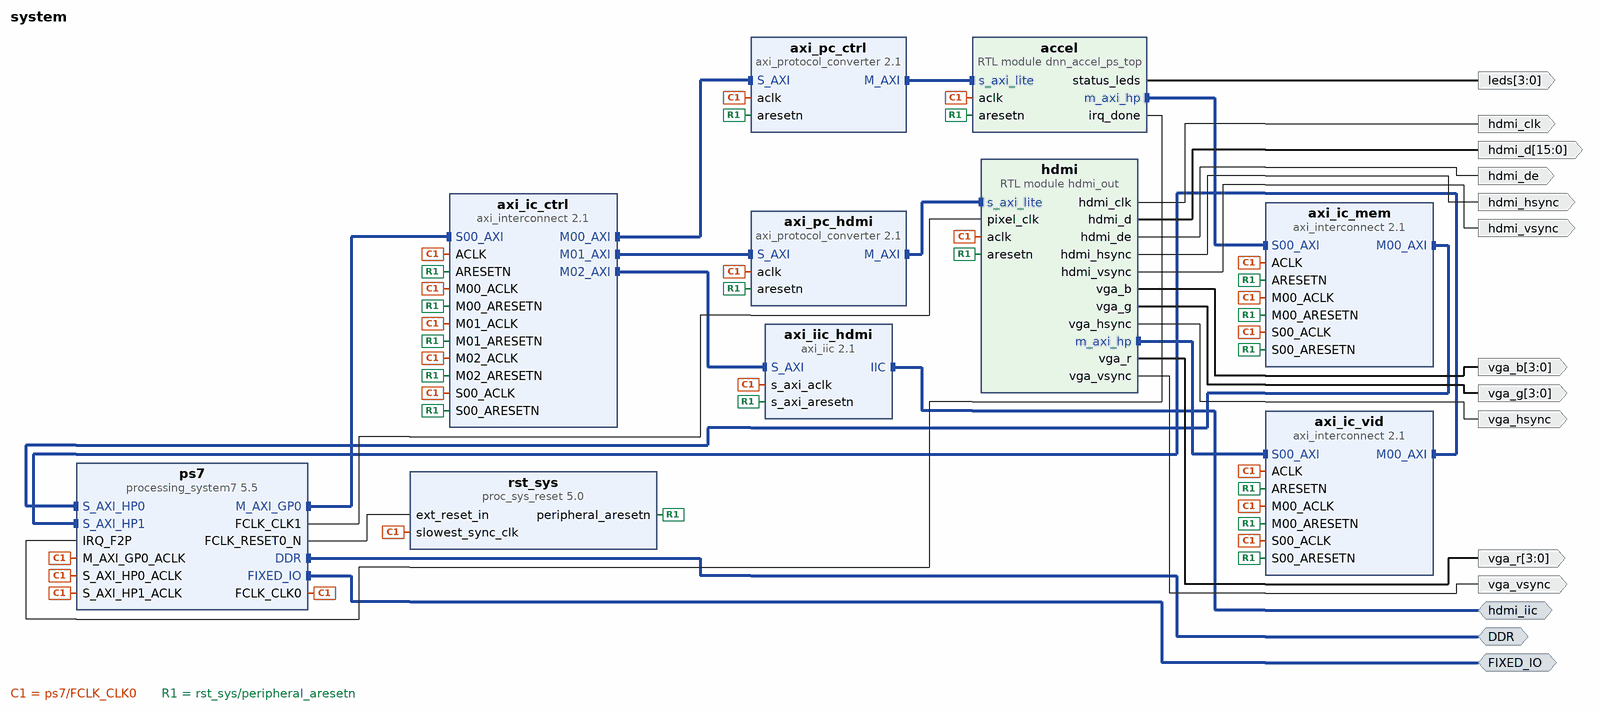
[diagram p0: block diagram of the top level]
# Vivado block design system, xc7z020clg484-1, Vivado 2025.2
create_bd_design system

create_bd_intf_port -mode Master -vlnv xilinx.com:interface:ddrx_rtl:1.0 DDR
create_bd_intf_port -mode Master -vlnv xilinx.com:display_processing_system7:fixedio_rtl:1.0 FIXED_IO
create_bd_intf_port -mode Master -vlnv xilinx.com:interface:iic_rtl:1.0 hdmi_iic
create_bd_port -dir O -from 3 -to 0 leds
create_bd_port -dir O hdmi_clk
create_bd_port -dir O -from 15 -to 0 hdmi_d
create_bd_port -dir O hdmi_de
create_bd_port -dir O hdmi_hsync
create_bd_port -dir O hdmi_vsync
create_bd_port -dir O -from 3 -to 0 vga_r
create_bd_port -dir O -from 3 -to 0 vga_g
create_bd_port -dir O -from 3 -to 0 vga_b
create_bd_port -dir O vga_hsync
create_bd_port -dir O vga_vsync

create_bd_cell -type ip -vlnv xilinx.com:ip:processing_system7:5.5 ps7
set_property -dict [list \
  CONFIG.PCW_APU_PERIPHERAL_FREQMHZ 650 \
  CONFIG.PCW_ENET0_ENET0_IO {MIO 16 .. 27} \
  CONFIG.PCW_ENET0_GRP_MDIO_ENABLE 1 \
  CONFIG.PCW_ENET0_GRP_MDIO_IO EMIO \
  CONFIG.PCW_ENET0_PERIPHERAL_ENABLE 1 \
  CONFIG.PCW_ENET0_RESET_ENABLE 0 \
  CONFIG.PCW_ENET_RESET_ENABLE 1 \
  CONFIG.PCW_ENET_RESET_SELECT {Share reset pin} \
  CONFIG.PCW_EN_CLK1_PORT 1 \
  CONFIG.PCW_FCLK_CLK1_BUF TRUE \
  CONFIG.PCW_FPGA0_PERIPHERAL_FREQMHZ 100 \
  CONFIG.PCW_FPGA1_PERIPHERAL_FREQMHZ 25 \
  CONFIG.PCW_FPGA_FCLK1_ENABLE 1 \
  CONFIG.PCW_GPIO_MIO_GPIO_ENABLE 1 \
  CONFIG.PCW_GPIO_MIO_GPIO_IO MIO \
  CONFIG.PCW_I2C_RESET_ENABLE 1 \
  CONFIG.PCW_IRQ_F2P_INTR 1 \
  CONFIG.PCW_PRESET_BANK1_VOLTAGE {LVCMOS 1.8V} \
  CONFIG.PCW_QSPI_GRP_FBCLK_ENABLE 1 \
  CONFIG.PCW_QSPI_GRP_FBCLK_IO {MIO 8} \
  CONFIG.PCW_QSPI_GRP_SINGLE_SS_ENABLE 1 \
  CONFIG.PCW_QSPI_GRP_SINGLE_SS_IO {MIO 1 .. 6} \
  CONFIG.PCW_QSPI_PERIPHERAL_ENABLE 1 \
  CONFIG.PCW_QSPI_QSPI_IO {MIO 1 .. 6} \
  CONFIG.PCW_SD0_GRP_CD_ENABLE 1 \
  CONFIG.PCW_SD0_GRP_CD_IO {MIO 47} \
  CONFIG.PCW_SD0_GRP_WP_ENABLE 1 \
  CONFIG.PCW_SD0_GRP_WP_IO EMIO \
  CONFIG.PCW_SD0_PERIPHERAL_ENABLE 1 \
  CONFIG.PCW_SD0_SD0_IO {MIO 40 .. 45} \
  CONFIG.PCW_SDIO_PERIPHERAL_FREQMHZ 50 \
  CONFIG.PCW_SINGLE_QSPI_DATA_MODE x4 \
  CONFIG.PCW_S_AXI_HP0_DATA_WIDTH 32 \
  CONFIG.PCW_S_AXI_HP1_DATA_WIDTH 32 \
  CONFIG.PCW_TTC0_PERIPHERAL_ENABLE 1 \
  CONFIG.PCW_TTC0_TTC0_IO EMIO \
  CONFIG.PCW_UART1_PERIPHERAL_ENABLE 1 \
  CONFIG.PCW_UART1_UART1_IO {MIO 48 .. 49} \
  CONFIG.PCW_UART_PERIPHERAL_FREQMHZ 100 \
  CONFIG.PCW_UIPARAM_DDR_FREQ_MHZ 525 \
  CONFIG.PCW_UIPARAM_DDR_PARTNO {MT41K128M16 JT-125} \
  CONFIG.PCW_USB0_PERIPHERAL_ENABLE 1 \
  CONFIG.PCW_USB0_RESET_ENABLE 1 \
  CONFIG.PCW_USB0_RESET_IO {MIO 46} \
  CONFIG.PCW_USB0_USB0_IO {MIO 28 .. 39} \
  CONFIG.PCW_USB_RESET_ENABLE 1 \
  CONFIG.PCW_USB_RESET_SELECT {Share reset pin} \
  CONFIG.PCW_USE_FABRIC_INTERRUPT 1 \
  CONFIG.PCW_USE_S_AXI_HP0 1 \
  CONFIG.PCW_USE_S_AXI_HP1 1 \
] [get_bd_cells ps7]
# 220 more settings of ps7 are not shown: defaults, MIO pin electricals, DDR timing, and values the tool derives
create_bd_cell -type module -reference dnn_accel_ps_top accel
create_bd_cell -type module -reference hdmi_out hdmi
create_bd_cell -type ip -vlnv xilinx.com:ip:axi_interconnect:2.1 axi_ic_ctrl
set_property -dict {CONFIG.NUM_MI 3 CONFIG.NUM_SI 1} [get_bd_cells axi_ic_ctrl]
create_bd_cell -type ip -vlnv xilinx.com:ip:axi_iic:2.1 axi_iic_hdmi
create_bd_cell -type ip -vlnv xilinx.com:ip:axi_interconnect:2.1 axi_ic_mem
set_property -dict {CONFIG.NUM_MI 1 CONFIG.NUM_SI 1} [get_bd_cells axi_ic_mem]
create_bd_cell -type ip -vlnv xilinx.com:ip:axi_protocol_converter:2.1 axi_pc_ctrl
create_bd_cell -type ip -vlnv xilinx.com:ip:axi_protocol_converter:2.1 axi_pc_hdmi
create_bd_cell -type ip -vlnv xilinx.com:ip:axi_interconnect:2.1 axi_ic_vid
set_property -dict {CONFIG.NUM_MI 1 CONFIG.NUM_SI 1} [get_bd_cells axi_ic_vid]
create_bd_cell -type ip -vlnv xilinx.com:ip:proc_sys_reset:5.0 rst_sys

# ---- connections ----

connect_bd_intf_net [get_bd_intf_pins accel/m_axi_hp] [get_bd_intf_pins axi_ic_mem/S00_AXI]
connect_bd_intf_net [get_bd_intf_pins axi_ic_ctrl/M00_AXI] [get_bd_intf_pins axi_pc_ctrl/S_AXI]
connect_bd_intf_net [get_bd_intf_pins axi_ic_ctrl/M01_AXI] [get_bd_intf_pins axi_pc_hdmi/S_AXI]
connect_bd_intf_net [get_bd_intf_pins axi_ic_ctrl/M02_AXI] [get_bd_intf_pins axi_iic_hdmi/S_AXI]
connect_bd_intf_net [get_bd_intf_pins axi_ic_mem/M00_AXI] [get_bd_intf_pins ps7/S_AXI_HP0]
connect_bd_intf_net [get_bd_intf_pins axi_ic_vid/M00_AXI] [get_bd_intf_pins ps7/S_AXI_HP1]
connect_bd_intf_net [get_bd_intf_ports hdmi_iic] [get_bd_intf_pins axi_iic_hdmi/IIC]
connect_bd_intf_net [get_bd_intf_pins axi_pc_ctrl/M_AXI] [get_bd_intf_pins accel/s_axi_lite]
connect_bd_intf_net [get_bd_intf_pins axi_pc_hdmi/M_AXI] [get_bd_intf_pins hdmi/s_axi_lite]
connect_bd_intf_net [get_bd_intf_pins hdmi/m_axi_hp] [get_bd_intf_pins axi_ic_vid/S00_AXI]
connect_bd_intf_net [get_bd_intf_ports DDR] [get_bd_intf_pins ps7/DDR]
connect_bd_intf_net [get_bd_intf_ports FIXED_IO] [get_bd_intf_pins ps7/FIXED_IO]
connect_bd_intf_net [get_bd_intf_pins ps7/M_AXI_GP0] [get_bd_intf_pins axi_ic_ctrl/S00_AXI]
connect_bd_net [get_bd_pins accel/irq_done] [get_bd_pins ps7/IRQ_F2P]
connect_bd_net [get_bd_pins accel/status_leds] [get_bd_ports leds]
connect_bd_net [get_bd_pins hdmi/hdmi_clk] [get_bd_ports hdmi_clk]
connect_bd_net [get_bd_pins hdmi/hdmi_d] [get_bd_ports hdmi_d]
connect_bd_net [get_bd_pins hdmi/hdmi_de] [get_bd_ports hdmi_de]
connect_bd_net [get_bd_pins hdmi/hdmi_hsync] [get_bd_ports hdmi_hsync]
connect_bd_net [get_bd_pins hdmi/hdmi_vsync] [get_bd_ports hdmi_vsync]
connect_bd_net [get_bd_pins hdmi/vga_b] [get_bd_ports vga_b]
connect_bd_net [get_bd_pins hdmi/vga_g] [get_bd_ports vga_g]
connect_bd_net [get_bd_pins hdmi/vga_hsync] [get_bd_ports vga_hsync]
connect_bd_net [get_bd_pins hdmi/vga_r] [get_bd_ports vga_r]
connect_bd_net [get_bd_pins hdmi/vga_vsync] [get_bd_ports vga_vsync]
connect_bd_net [get_bd_pins ps7/FCLK_CLK0] \
  [get_bd_pins ps7/M_AXI_GP0_ACLK] [get_bd_pins ps7/S_AXI_HP0_ACLK] [get_bd_pins rst_sys/slowest_sync_clk] \
  [get_bd_pins axi_ic_ctrl/ACLK] [get_bd_pins axi_ic_ctrl/S00_ACLK] [get_bd_pins axi_ic_ctrl/M00_ACLK] \
  [get_bd_pins axi_ic_mem/ACLK] [get_bd_pins axi_ic_mem/S00_ACLK] [get_bd_pins axi_ic_mem/M00_ACLK] \
  [get_bd_pins axi_ic_ctrl/M01_ACLK] [get_bd_pins axi_ic_ctrl/M02_ACLK] [get_bd_pins axi_iic_hdmi/s_axi_aclk] \
  [get_bd_pins ps7/S_AXI_HP1_ACLK] [get_bd_pins axi_ic_vid/ACLK] [get_bd_pins axi_ic_vid/S00_ACLK] \
  [get_bd_pins axi_ic_vid/M00_ACLK] [get_bd_pins axi_pc_ctrl/aclk] [get_bd_pins axi_pc_hdmi/aclk] [get_bd_pins accel/aclk] \
  [get_bd_pins hdmi/aclk]
connect_bd_net [get_bd_pins ps7/FCLK_CLK1] [get_bd_pins hdmi/pixel_clk]
connect_bd_net [get_bd_pins ps7/FCLK_RESET0_N] [get_bd_pins rst_sys/ext_reset_in]
connect_bd_net [get_bd_pins rst_sys/peripheral_aresetn] \
  [get_bd_pins axi_ic_ctrl/ARESETN] [get_bd_pins axi_ic_ctrl/S00_ARESETN] [get_bd_pins axi_ic_ctrl/M00_ARESETN] \
  [get_bd_pins axi_ic_mem/ARESETN] [get_bd_pins axi_ic_mem/S00_ARESETN] [get_bd_pins axi_ic_mem/M00_ARESETN] \
  [get_bd_pins axi_ic_ctrl/M01_ARESETN] [get_bd_pins axi_ic_ctrl/M02_ARESETN] [get_bd_pins axi_iic_hdmi/s_axi_aresetn] \
  [get_bd_pins axi_ic_vid/ARESETN] [get_bd_pins axi_ic_vid/S00_ARESETN] [get_bd_pins axi_ic_vid/M00_ARESETN] \
  [get_bd_pins axi_pc_ctrl/aresetn] [get_bd_pins axi_pc_hdmi/aresetn] [get_bd_pins accel/aresetn] [get_bd_pins hdmi/aresetn]

# ---- address map ----
assign_bd_address -offset 0x00000000 -range 512M -target_address_space [get_bd_addr_spaces accel/m_axi_hp] [get_bd_addr_segs ps7/S_AXI_HP0/HP0_DDR_LOWOCM]
assign_bd_address -offset 0x00000000 -range 512M -target_address_space [get_bd_addr_spaces hdmi/m_axi_hp] [get_bd_addr_segs ps7/S_AXI_HP1/HP1_DDR_LOWOCM]
assign_bd_address -offset 0x43C00000 -range 64K -target_address_space [get_bd_addr_spaces ps7/Data] [get_bd_addr_segs accel/s_axi_lite/reg0]
assign_bd_address -offset 0x43C10000 -range 64K -target_address_space [get_bd_addr_spaces ps7/Data] [get_bd_addr_segs hdmi/s_axi_lite/reg0]
assign_bd_address -offset 0x43C20000 -range 64K -target_address_space [get_bd_addr_spaces ps7/Data] [get_bd_addr_segs axi_iic_hdmi/S_AXI/Reg]

validate_bd_design
save_bd_design
